# Altium schematic sheet Description.SchDoc
size A4; SheetNumber: 10; SheetTotal: 11
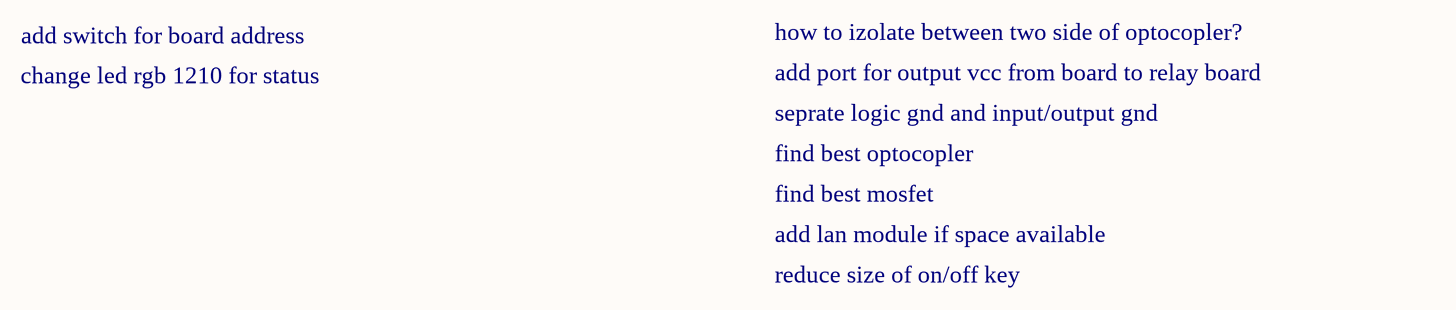
[diagram p0: Description.SchDoc]

## Notes on the sheet
- add switch for board address
- how to izolate between two side of optocopler?
- change led rgb 1210 for status
- add port for output vcc from board to relay board
- seprate logic gnd and input/output gnd
- find best optocopler
- find best mosfet
- add lan module if space available
- reduce size of on/off key